# Altium schematic sheet SC20.SchDoc
size 420 x 297 mm; SheetNumber: 2; SheetTotal: 4
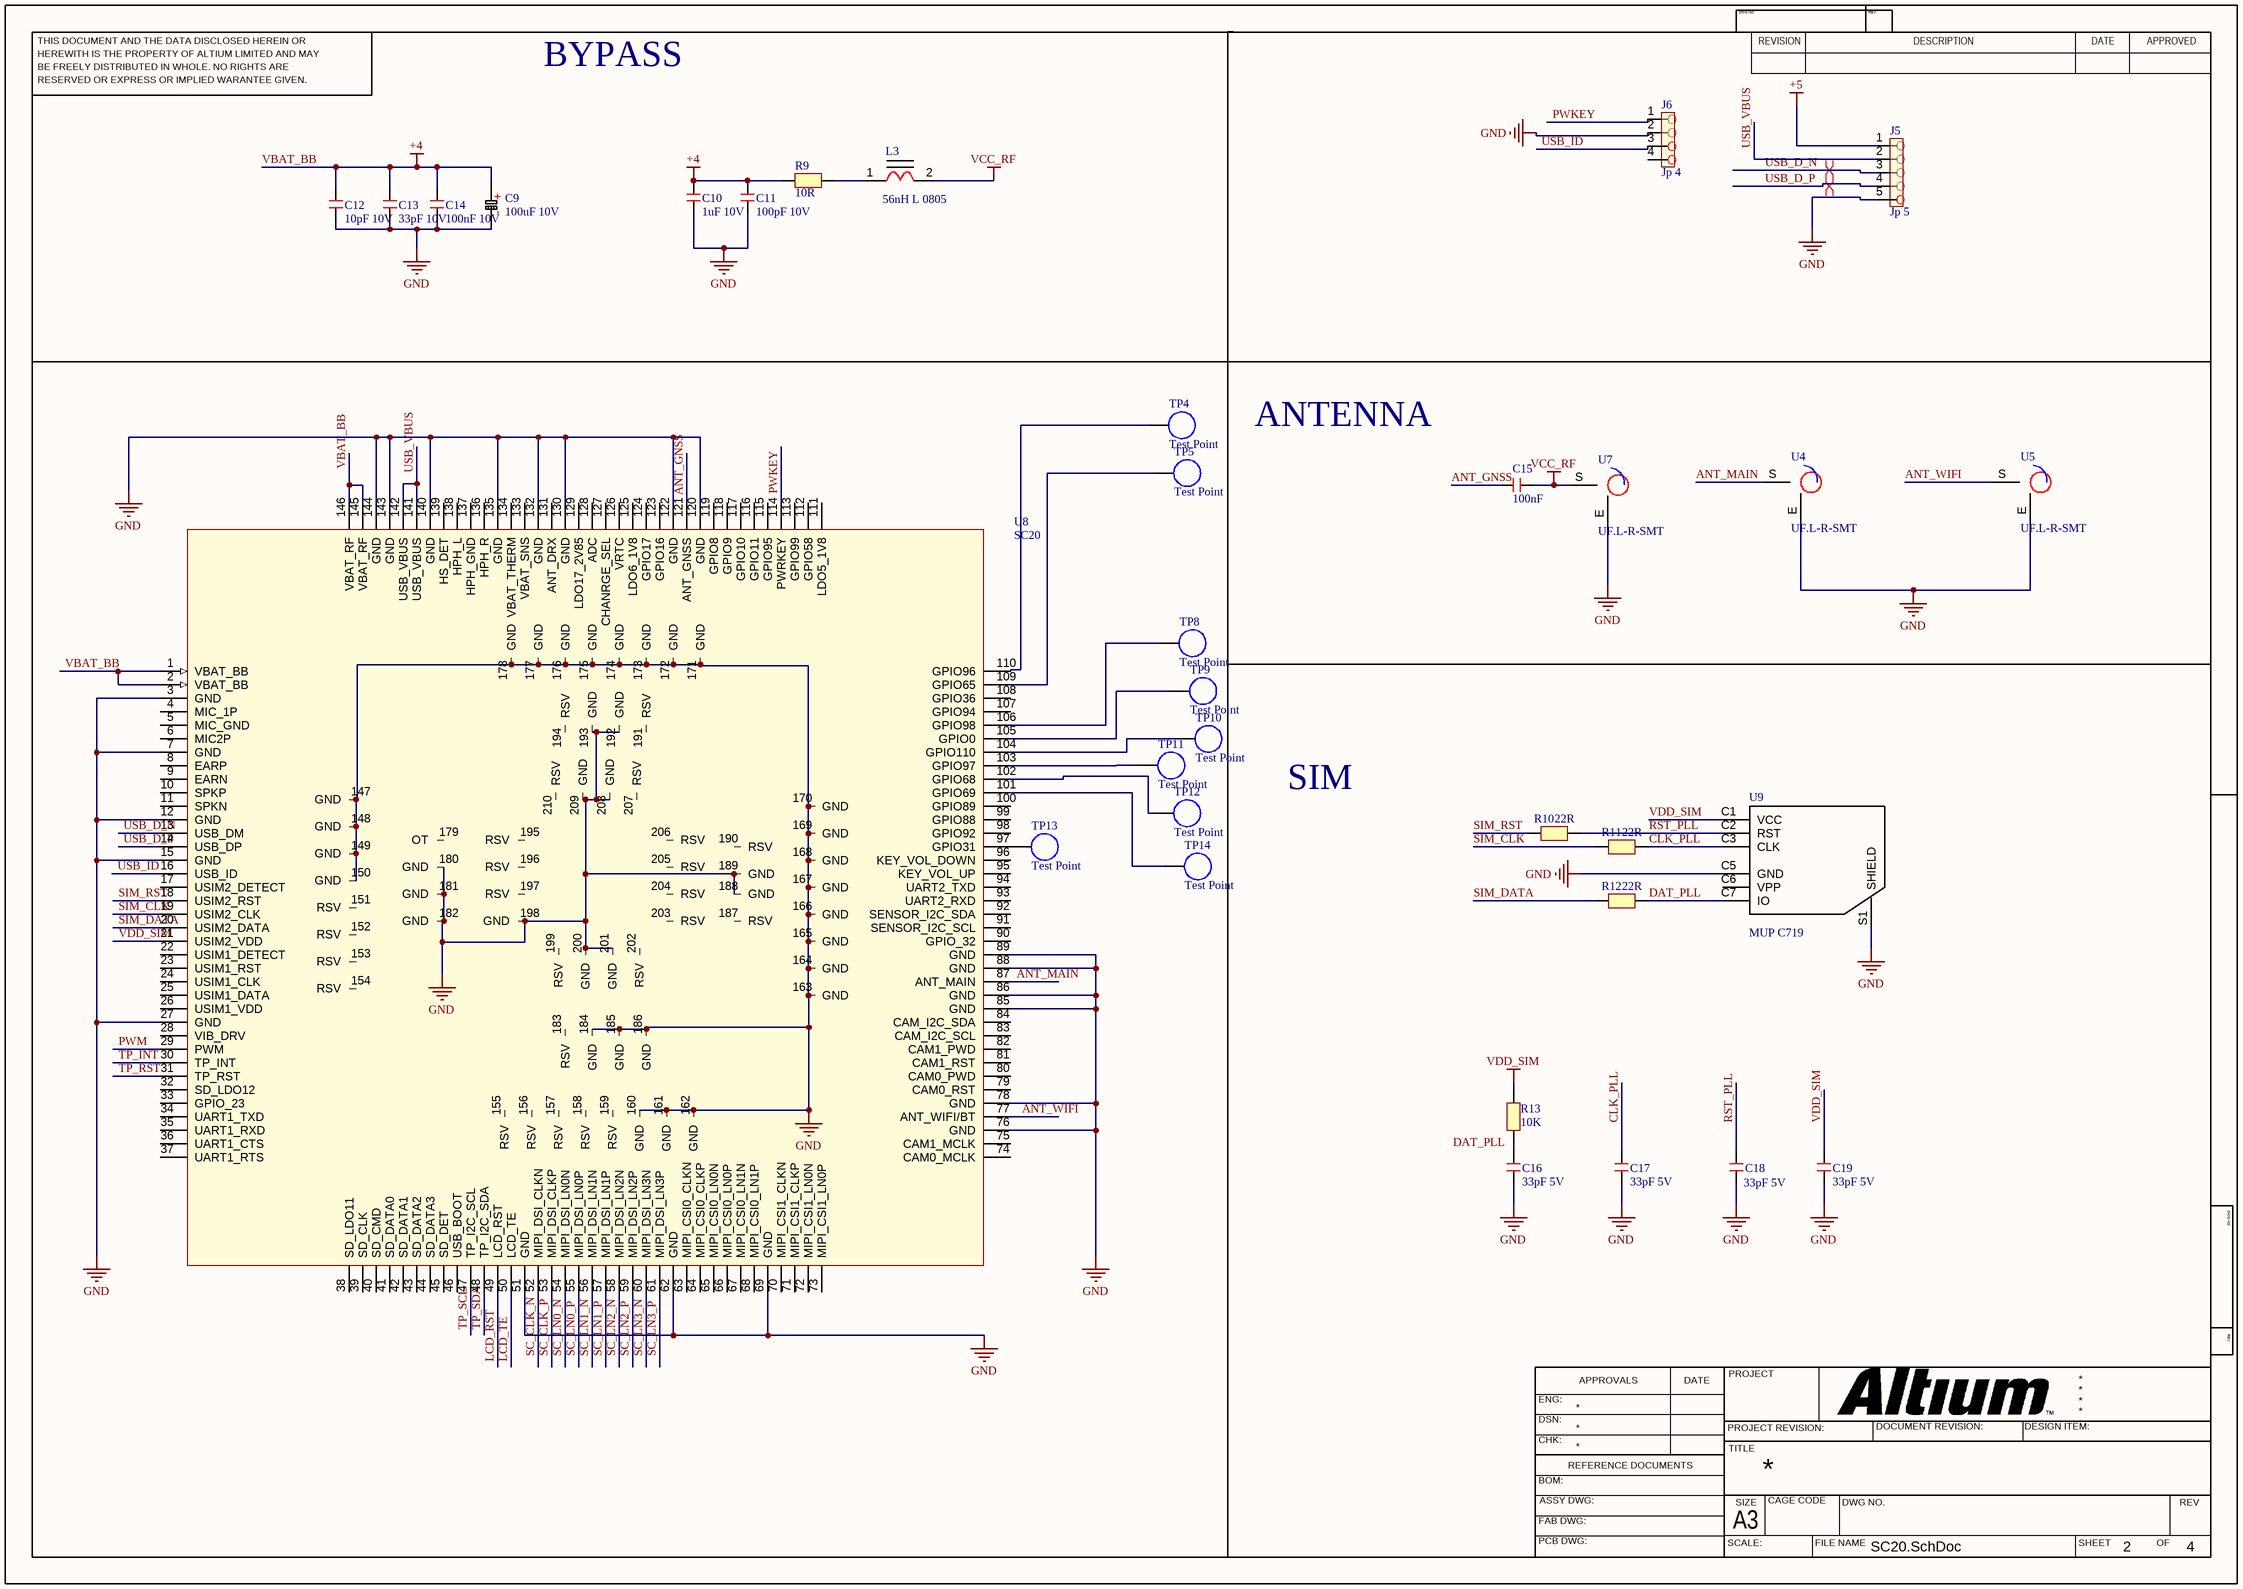
[diagram p0: SC20.SchDoc]

## Parts
C9  100uF 10V  [CAPACITOR TALTALIUM 7443]
C10  1uF 10V  [C 0805]
C11  100pF 10V  [C 0805]
C12  10pF 10V  [C 0805]
C13  33pF 10V  [C 0805]
C14  100nF 10V  [C 0805]
C15  100nF  [C 0805]
C16  33pF 5V  [C 0805]
C17  33pF 5V  [C 0805]
C18  33pF 5V  [C 0805]
C19  33pF 5V  [C 0805]
J5  Jp 5  [Jp5]
J6  Jp 4  [Jp4]
L3  56nH L 0805  [Ferrite 0805]
R9  10R  [R 0805]
R10  22R  [R 0805]
R11  22R  [R 0805]
R12  22R  [R 0805]
R13  10K  [R 0805]
TP4  Test Point  [Test Point]
TP5  Test Point  [Test Point]
TP8  Test Point  [Test Point]
TP9  Test Point  [Test Point]
TP10  Test Point  [Test Point]
TP11  Test Point  [Test Point]
TP12  Test Point  [Test Point]
TP13  Test Point  [Test Point]
TP14  Test Point  [Test Point]
U4  UF.L-R-SMT  [UFL]
U5  UF.L-R-SMT  [UFL]
U7  UF.L-R-SMT  [UFL]
U8  SC20  [SC20]
U9  MUP C719  [MPU C719]

## Nets
+5: J5.1
GND: C9.2 C10.1 C11.1 C12.1 C13.1 C14.1 C16.1 C17.1 C18.1 C19.1 J5.5 J6.2 U4.E U5.E U7.E U8.3(GND) U8.7(GND) U8.12(GND) U8.15(GND) U8.27(GND) U8.51(GND) U8.62(GND) U8.69(GND) U8.76(GND) U8.78(GND) U8.85(GND) U8.86(GND) U8.88(GND) U8.89(GND) U8.120(GND) U8.122(GND) U8.130(GND) U8.132(GND) U8.135(GND) U8.140(GND) U8.143(GND) U8.144(GND) U8.147(GND) U8.148(GND) U8.149(GND) U8.150(GND) U8.160(GND) U8.161(GND) U8.162(GND) U8.163(GND) U8.164(GND) U8.165(GND) U8.166(GND) U8.167(GND) U8.168(GND) U8.169(GND) U8.170(GND) U8.171(GND) U8.172(GND) U8.173(GND) U8.174(GND) U8.175(GND) U8.176(GND) U8.177(GND) U8.178(GND) U8.180(GND) U8.181(GND) U8.182(GND) U8.184(GND) U8.185(GND) U8.186(GND) U8.188(GND) U8.189(GND) U8.192(GND) U8.193(GND) U8.198(GND) U8.200(GND) U8.201(GND) U8.208(GND) U8.209(GND) U9.C5(GND) U9.S1(SHIELD)
VBAT_BB: C9.1 C10.2 C11.2 C12.2 C13.2 C14.2 R9.2 U8.1(VBAT_BB) U8.2(VBAT_BB) U8.145(VBAT_RF) U8.146(VBAT_RF)  [also labelled +4]
VCC_RF: C15.1 L3.2 U7.S
VDD_SIM: C19.2 R13.2 U8.21(USIM2_VDD) U9.C1(VCC)
ANT_GNSS: C15.2 U8.121(ANT_GNSS)
ANT_MAIN: U4.S U8.87(ANT_MAIN)
ANT_WIFI: U5.S U8.77(ANT_WIFI/BT)
CLK_PLL: C17.2 R11.2 U9.C3(CLK)
DAT_PLL: R12.2 U9.C7(IO)
LCD_RST: U8.49(LCD_RST)
LCD_TE: U8.50(LCD_TE)
PWKEY: J6.1 U8.114(PWRKEY)
PWM: U8.29(PWM)
RST_PLL: C18.2 R10.2 U9.C2(RST)
SC_CLK_N: U8.52(MIPI_DSI_CLKN)
SC_CLK_P: U8.53(MIPI_DSI_CLKP)
SC_LN0_N: U8.54(MIPI_DSI_LN0N)
SC_LN0_P: U8.55(MIPI_DSI_LN0P)
SC_LN1_N: U8.56(MIPI_DSI_LN1N)
SC_LN1_P: U8.57(MIPI_DSI_LN1P)
SC_LN2_N: U8.58(MIPI_DSI_LN2N)
SC_LN2_P: U8.59(MIPI_DSI_LN2P)
SC_LN3_N: U8.60(MIPI_DSI_LN3N)
SC_LN3_P: U8.61(MIPI_DSI_LN3P)
SIM_CLK: R11.1 U8.19(USIM2_CLK)
SIM_DATA: R12.1 U8.20(USIM2_DATA)
SIM_RST: R10.1 U8.18(USIM2_RST)
TP_INT: U8.30(TP_INT)
TP_RST: U8.31(TP_RST)
TP_SCL: U8.47(TP_I2C_SCL)
TP_SDA: U8.48(TP_I2C_SDA)
USB_D_N: J5.3 U8.13(USB_DM)
USB_D_P: J5.4 U8.14(USB_DP)
USB_ID: J6.3 U8.16(USB_ID)
USB_VBUS: J5.2 U8.141(USB_VBUS) U8.142(USB_VBUS)
NetC16_2: C16.2 R13.1
NetL3_1: L3.1 R9.1
NetTP4_1: TP4.1 U8.110(GPIO96)
NetTP5_1: TP5.1 U8.109(GPIO65)
NetTP8_1: TP8.1 U8.106(GPIO98)
NetTP9_1: TP9.1 U8.105(GPIO0)
NetTP10_1: TP10.1 U8.104(GPIO110)
NetTP11_1: TP11.1 U8.103(GPIO97)
NetTP12_1: TP12.1 U8.102(GPIO68)
NetTP13_1: TP13.1 U8.97(GPIO31)
NetTP14_1: TP14.1 U8.101(GPIO69)

Not connected (* = marked no-connect by the designer): J6 4; U8 4(MIC_1P) 5(MIC_GND) 6(MIC2P) 8(EARP) 9(EARN) 10(SPKP) 11(SPKN) 17(USIM2_DETECT) 22(USIM1_DETECT) 23(USIM1_RST) 24(USIM1_CLK) 25(USIM1_DATA) 26(USIM1_VDD) 28(VIB_DRV) 32(SD_LDO12) 33(GPIO_23) 34(UART1_TXD) 35(UART1_RXD) 36(UART1_CTS) 37(UART1_RTS) 38(SD_LDO11) 39(SD_CLK) 40(SD_CMD) 41(SD_DATA0) 42(SD_DATA1) 43(SD_DATA2) 44(SD_DATA3) 45(SD_DET) 46(USB_BOOT) 63(MIPI_CSI0_CLKN) 64(MIPI_CSI0_CLKP) 65(MIPI_CSI0_LN0N) 66(MIPI_CSI0_LN0P) 67(MIPI_CSI0_LN1N) 68(MIPI_CSI0_LN1P) 70(MIPI_CSI1_CLKN) 71(MIPI_CSI1_CLKP) 72(MIPI_CSI1_LN0N) 73(MIPI_CSI1_LN0P) 74(CAM0_MCLK) 75(CAM1_MCLK) 79(CAM0_RST) 80(CAM0_PWD) 81(CAM1_RST) 82(CAM1_PWD) 83(CAM_I2C_SCL) 84(CAM_I2C_SDA) 90(GPIO_32) 91(SENSOR_I2C_SCL) 92(SENSOR_I2C_SDA) 93(UART2_RXD) 94(UART2_TXD) 95(KEY_VOL_UP) 96(KEY_VOL_DOWN) 98(GPIO92) 99(GPIO88) 100(GPIO89) 107(GPIO94) 108(GPIO36) 111(LDO5_1V8) 112(GPIO58) 113(GPIO99) 115(GPIO95) 116(GPIO11) 117(GPIO10) 118(GPIO9) 119(GPIO8) 123(GPIO16) 124(GPIO17) 125(LDO6_1V8) 126(VRTC) 127(CHANRGE_SEL) 128(ADC) 129(LDO17_2V85) 131(ANT_DRX) 133(VBAT_SNS) 134(VBAT_THERM) 136(HPH_R) 137(HPH_GND) 138(HPH_L) 139(HS_DET) 151(RSV) 152(RSV) 153(RSV) 154(RSV) 155(RSV) 156(RSV) 157(RSV) 158(RSV) 159(RSV) 179(OT) 183(RSV) 187(RSV) 190(RSV) 191(RSV) 194(RSV) 195(RSV) 196(RSV) 197(RSV) 199(RSV) 202(RSV) 203(RSV) 204(RSV) 205(RSV) 206(RSV) 207(RSV) 210(RSV); U9 C6(VPP)

## Layout directives
differential pair: USB_D_N, USB_D_P

## Notes on the sheet
- BYPASS
- ANTENNA
- SIM
- Labels drawn without touching a wire or pin: DAT_PLL
- THIS DOCUMENT AND THE DATA DISCLOSED HEREIN OR
- HEREWITH IS THE PROPERTY OF ALTIUM LIMITED AND MAY
- DWG NO:
- REVISION
- REV:
- DESCRIPTION
- DATE
- APPROVED
- BE FREELY DISTRIBUTED IN WHOLE. NO RIGHTS ARE
- RESERVED OR EXPRESS OR IMPLIED WARANTEE GIVEN.
- ENG:
- APPROVALS
- PROJECT
- DSN:
- CHK:
- REFERENCE DOCUMENTS
- PROJECT REVISION:
- TITLE
- DOCUMENT REVISION:
- DESIGN ITEM:
- BOM:
- FAB DWG:
- PCB DWG:
- ASSY DWG:
- SCALE:
- A3
- SIZE
- CAGE CODE
- FILE NAME
- DWG NO.
- SHEET
- OF
- REV
- (in symbol C Polarize 8x10.2) +; -

## Library data of the parts
C9 = C Polarize 8x10.2
C10-C19 = C 0805
L3 = Ferite 0805
R9-R13 = R 0805